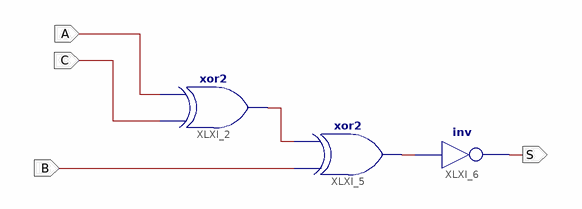
[diagram p0: schematic sheet 1]
// Xilinx ISE schematic ex02.sch (artix7) as structural Verilog: 3 symbols, 4 ports
module ex02 (
  input  C,
  input  B,
  input  A,
  output S
);

  wire saida, XLXN_15;

  xor XLXI_2 (XLXN_15, C, A);
  xor XLXI_5 (saida, B, XLXN_15);
  not XLXI_6 (S, saida);
endmodule
